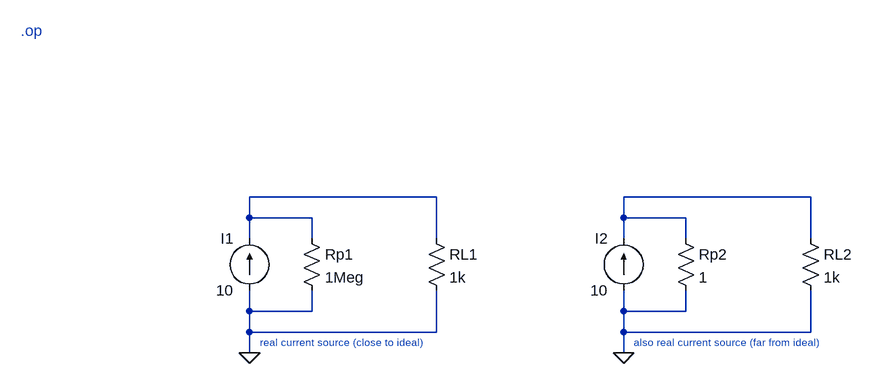
[diagram p0: schematic circuit.asc]
circuit.asc, the LTspice schematic file:
Version 4.1
SHEET 1 928 680
WIRE 128 272 -160 272
WIRE 704 272 416 272
WIRE -160 304 -160 272
WIRE -64 304 -160 304
WIRE 416 304 416 272
WIRE 512 304 416 304
WIRE -160 336 -160 304
WIRE -64 336 -64 304
WIRE 128 336 128 272
WIRE 416 336 416 304
WIRE 512 336 512 304
WIRE 704 336 704 272
WIRE -160 448 -160 416
WIRE -64 448 -64 416
WIRE -64 448 -160 448
WIRE 416 448 416 416
WIRE 512 448 512 416
WIRE 512 448 416 448
WIRE -160 480 -160 448
WIRE 128 480 128 416
WIRE 128 480 -160 480
WIRE 416 480 416 448
WIRE 704 480 704 416
WIRE 704 480 416 480
WIRE -160 512 -160 480
WIRE 416 512 416 480
FLAG -160 512 0
FLAG 416 512 0
DATAFLAG 208 320 "I(RL1)"
DATAFLAG 800 320 "I(RL2)"
SYMBOL current -160 416 R180
WINDOW 0 24 80 Left 2
WINDOW 3 24 0 Left 2
WINDOW 123 0 0 Left 0
WINDOW 39 0 0 Left 0
SYMATTR InstName I1
SYMATTR Value 10
SYMBOL res -80 320 R0
SYMATTR InstName Rp1
SYMATTR Value 1Meg
SYMBOL res 112 320 R0
SYMATTR InstName RL1
SYMATTR Value 1k
SYMBOL current 416 416 R180
WINDOW 0 24 80 Left 2
WINDOW 3 24 0 Left 2
WINDOW 123 0 0 Left 0
WINDOW 39 0 0 Left 0
SYMATTR InstName I2
SYMATTR Value 10
SYMBOL res 496 320 R0
SYMATTR InstName Rp2
SYMATTR Value 1
SYMBOL res 688 320 R0
SYMATTR InstName RL2
SYMATTR Value 1k
TEXT -512 16 Left 2 ;.op
TEXT -144 496 Left 1 ;real current source (close to ideal)
TEXT 432 496 Left 1 ;also real current source (far from ideal)

The netlist it stands for:
* circuit.asc
I1 0 N001 10
Rp1 N001 0 1Meg
RL1 N001 0 1k
I2 0 N002 10
Rp2 N002 0 1
RL2 N002 0 1k
* .op
* real current source (close to ideal)
* also real current source (far from ideal)
.backanno
.end